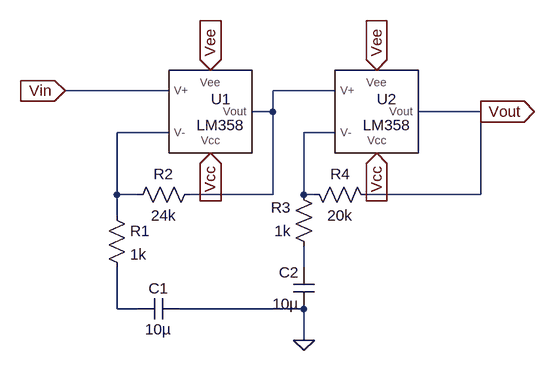
[diagram p0: schematic gain_stage_1.asc]
gain_stage_1.asc, the LTspice schematic file:
Version 4
SHEET 1 880 680
WIRE 64 160 -96 160
WIRE 320 160 224 160
WIRE 224 192 224 160
WIRE 224 192 192 192
WIRE 544 192 448 192
WIRE 64 224 -16 224
WIRE 320 224 272 224
WIRE -16 320 -16 224
WIRE 16 320 -16 320
WIRE 224 320 224 192
WIRE 224 320 96 320
WIRE 272 320 272 224
WIRE 288 320 272 320
WIRE 544 320 544 192
WIRE 544 320 368 320
WIRE -16 352 -16 320
WIRE 272 432 272 400
WIRE -16 496 -16 432
WIRE 16 496 -16 496
WIRE 272 496 80 496
WIRE 272 544 272 496
FLAG 128 256 Vcc
IOPIN 128 256 In
FLAG 128 128 Vee
IOPIN 128 128 In
FLAG 272 544 0
FLAG -96 160 Vin
IOPIN -96 160 In
FLAG 544 192 Vout
IOPIN 544 192 Out
FLAG 384 128 Vee
IOPIN 384 128 In
FLAG 384 256 Vcc
IOPIN 384 256 In
SYMBOL res -32 336 R0
SYMATTR InstName R1
SYMATTR Value 1k
SYMBOL res 112 304 R90
WINDOW 0 0 56 VBottom 2
WINDOW 3 32 56 VTop 2
SYMATTR InstName R2
SYMATTR Value 24k
SYMBOL res 288 416 R180
WINDOW 0 36 76 Left 2
WINDOW 3 36 40 Left 2
SYMATTR InstName R3
SYMATTR Value 1k
SYMBOL res 272 304 M90
WINDOW 0 0 56 VBottom 2
WINDOW 3 32 56 VTop 2
SYMATTR InstName R4
SYMATTR Value 20k
SYMBOL cap 80 480 R90
WINDOW 0 0 32 VBottom 2
WINDOW 3 32 32 VTop 2
SYMATTR InstName C1
SYMATTR Value 10µ
SYMBOL cap 288 496 R180
WINDOW 0 24 56 Left 2
WINDOW 3 24 8 Left 2
SYMATTR InstName C2
SYMATTR Value 10µ
SYMBOL LM358 144 192 M180
SYMATTR InstName U1
SYMBOL LM358 400 192 M180
SYMATTR InstName U2

The netlist it stands for:
* gain_stage_1.asc
R1 N002 N005 1k
R2 N001 N002 24k
R3 N004 N003 1k
R4 N003 Vout 20k
C1 0 N005 10µ
C2 0 N004 10µ
XU1 N002 Vin N001 Vcc Vee LM358  ; pins V- V+ Vout Vcc Vee
XU2 N003 N001 Vout Vcc Vee LM358  ; pins V- V+ Vout Vcc Vee
.lib C:\Users\leoar\Documents\EE2\Project\Radar\SPICEMODELS\en.lm358\lm358.txt
.backanno
.end